# Altium schematic sheet Sheet2.SchDoc: Наименование
size 420 x 297 mm; ApprovedBy: Vasil; CheckedBy: Vasil; Author: Vasil; CompanyName: Vasil; DrawnBy: n.a.; Engineer: Vasil; SheetNumber: 2; SheetTotal: 5; PageSetup: Record=PageOptions|CenterHorizontal=True|CenterVertical=True|PrintScale=0.94|XCorrection=1.00|YCorrection=1.00|PrintKind=1|BorderSize=5000000|LeftOffset=0|BottomOffset=0|Orientation=1|PaperLength=1000|PaperWidth=1000|Scale=100|PaperSource=7|PrintQuality=-4|MediaType=1|DitherType=10|PaperKind=A4|PrintScaleMode=1; DecimalNumber: 000.00006.001.VG; HeadOfSector: n.a.; MainDevice: HW; Name: CNC_interfaces_board; DocumentName: Sheet1.SCHDOC
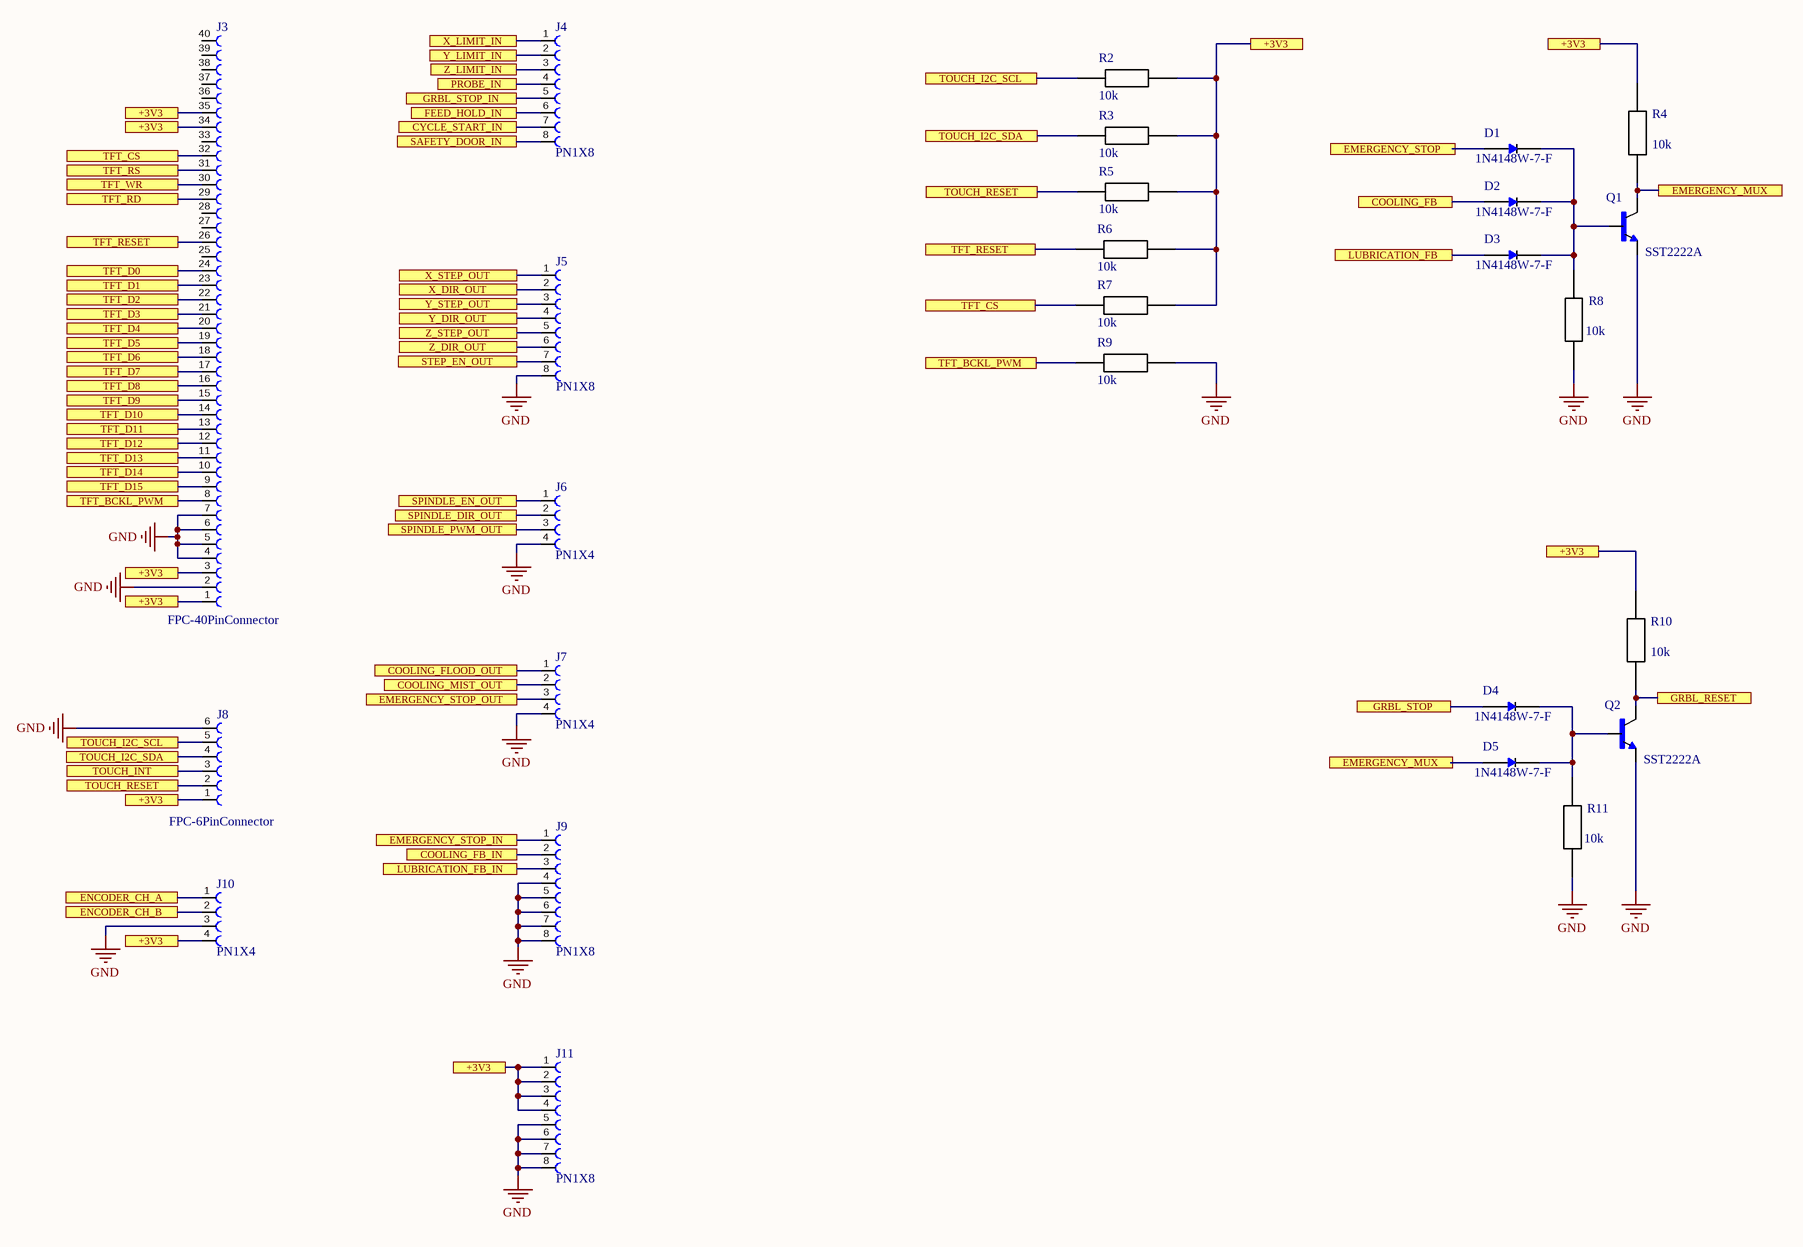
[diagram p0: Sheet2.SchDoc]

## Parts
D1  1N4148W-7-F  [SOD123]
D2  1N4148W-7-F  [SOD123]
D3  1N4148W-7-F  [SOD123]
D4  1N4148W-7-F  [SOD123]
D5  1N4148W-7-F  [SOD123]
J3  FPC-40PinConnector  [687140149022]
J4  PN1X8  [PN1X8]
J5  PN1X8  [PN1X8]
J6  PN1X4  [PN1X4]
J7  PN1X4  [PN1X4]
J8  FPC-6PinConnector  [687106149022]
J9  PN1X8  [PN1X8]
J10  PN1X4  [PN1X4]
J11  PN1X8  [PN1X8]
Q1  SST2222A  [SOT-23-3]
Q2  SST2222A  [SOT-23-3]
R2  10k  [SMD 0805]
R3  10k  [SMD 0805]
R4  10k  [SMD 0805]
R5  10k  [SMD 0805]
R6  10k  [SMD 0805]
R7  10k  [SMD 0805]
R8  10k  [SMD 0805]
R9  10k  [SMD 0805]
R10  10k  [SMD 0805]
R11  10k  [SMD 0805]

## Ports
+3V3, COOLING_FB, COOLING_FB_IN, COOLING_FLOOD_OUT, COOLING_MIST_OUT, CYCLE_START_IN, EMERGENCY_MUX, EMERGENCY_STOP, EMERGENCY_STOP_IN, EMERGENCY_STOP_OUT, ENCODER_CH_A, ENCODER_CH_B, FEED_HOLD_IN, GRBL_RESET, GRBL_STOP, GRBL_STOP_IN, LUBRICATION_FB, LUBRICATION_FB_IN, PROBE_IN, SAFETY_DOOR_IN, SPINDLE_DIR_OUT, SPINDLE_EN_OUT, SPINDLE_PWM_OUT, STEP_EN_OUT, TFT_BCKL_PWM, TFT_CS, TFT_D0, TFT_D1, TFT_D2, TFT_D3, TFT_D4, TFT_D5, TFT_D6, TFT_D7, TFT_D8, TFT_D9, TFT_D10, TFT_D11, TFT_D12, TFT_D13, TFT_D14, TFT_D15, TFT_RD, TFT_RESET, TFT_RS, TFT_WR, TOUCH_I2C_SCL, TOUCH_I2C_SDA, TOUCH_INT, TOUCH_RESET, X_DIR_OUT, X_LIMIT_IN, X_STEP_OUT, Y_DIR_OUT, Y_LIMIT_IN, Y_STEP_OUT, Z_DIR_OUT, Z_LIMIT_IN, Z_STEP_OUT

## Nets
GND: J3.2 J3.4 J3.5 J3.6 J3.7 J5.8 J6.4 J7.4 J8.6 J9.4 J9.5 J9.6 J9.7 J9.8 J10.3 J11.5 J11.6 J11.7 J11.8 Q1.1(E) Q2.1(E) R8.2 R9.2 R11.2
+3V3: J3.1 J3.3 J3.34 J3.35 J8.1 J10.4 J11.1 J11.2 J11.3 J11.4 R2.1 R3.2 R4.1 R5.2 R6.1 R7.1 R10.1 ; port +3V3
COOLING_FB: D2.A ; port COOLING_FB
COOLING_FB_IN: J9.2 ; port COOLING_FB_IN
COOLING_FLOOD_OUT: J7.1 ; port COOLING_FLOOD_OUT
COOLING_MIST_OUT: J7.2 ; port COOLING_MIST_OUT
CYCLE_START_IN: J4.7 ; port CYCLE_START_IN
EMERGENCY_MUX: D5.A Q1.3(C) R4.2 ; port EMERGENCY_MUX
EMERGENCY_STOP: D1.A ; port EMERGENCY_STOP
EMERGENCY_STOP_IN: J9.1 ; port EMERGENCY_STOP_IN
EMERGENCY_STOP_OUT: J7.3 ; port EMERGENCY_STOP_OUT
ENCODER_CH_A: J10.1 ; port ENCODER_CH_A
ENCODER_CH_B: J10.2 ; port ENCODER_CH_B
FEED_HOLD_IN: J4.6 ; port FEED_HOLD_IN
GRBL_RESET: Q2.3(C) R10.2 ; port GRBL_RESET
GRBL_STOP: D4.A ; port GRBL_STOP
GRBL_STOP_IN: J4.5 ; port GRBL_STOP_IN
LUBRICATION_FB: D3.A ; port LUBRICATION_FB
LUBRICATION_FB_IN: J9.3 ; port LUBRICATION_FB_IN
PROBE_IN: J4.4 ; port PROBE_IN
SAFETY_DOOR_IN: J4.8 ; port SAFETY_DOOR_IN
SPINDLE_DIR_OUT: J6.2 ; port SPINDLE_DIR_OUT
SPINDLE_EN_OUT: J6.1 ; port SPINDLE_EN_OUT
SPINDLE_PWM_OUT: J6.3 ; port SPINDLE_PWM_OUT
STEP_EN_OUT: J5.7 ; port STEP_EN_OUT
TFT_BCKL_PWM: J3.8 R9.1 ; port TFT_BCKL_PWM
TFT_CS: J3.32 R7.2 ; port TFT_CS
TFT_D0: J3.24 ; port TFT_D0
TFT_D1: J3.23 ; port TFT_D1
TFT_D2: J3.22 ; port TFT_D2
TFT_D3: J3.21 ; port TFT_D3
TFT_D4: J3.20 ; port TFT_D4
TFT_D5: J3.19 ; port TFT_D5
TFT_D6: J3.18 ; port TFT_D6
TFT_D7: J3.17 ; port TFT_D7
TFT_D8: J3.16 ; port TFT_D8
TFT_D9: J3.15 ; port TFT_D9
TFT_D10: J3.14 ; port TFT_D10
TFT_D11: J3.13 ; port TFT_D11
TFT_D12: J3.12 ; port TFT_D12
TFT_D13: J3.11 ; port TFT_D13
TFT_D14: J3.10 ; port TFT_D14
TFT_D15: J3.9 ; port TFT_D15
TFT_RD: J3.29 ; port TFT_RD
TFT_RESET: J3.26 R6.2 ; port TFT_RESET
TFT_RS: J3.31 ; port TFT_RS
TFT_WR: J3.30 ; port TFT_WR
TOUCH_I2C_SCL: J8.5 R2.2 ; port TOUCH_I2C_SCL
TOUCH_I2C_SDA: J8.4 R3.1 ; port TOUCH_I2C_SDA
TOUCH_INT: J8.3 ; port TOUCH_INT
TOUCH_RESET: J8.2 R5.1 ; port TOUCH_RESET
X_DIR_OUT: J5.2 ; port X_DIR_OUT
X_LIMIT_IN: J4.1 ; port X_LIMIT_IN
X_STEP_OUT: J5.1 ; port X_STEP_OUT
Y_DIR_OUT: J5.4 ; port Y_DIR_OUT
Y_LIMIT_IN: J4.2 ; port Y_LIMIT_IN
Y_STEP_OUT: J5.3 ; port Y_STEP_OUT
Z_DIR_OUT: J5.6 ; port Z_DIR_OUT
Z_LIMIT_IN: J4.3 ; port Z_LIMIT_IN
Z_STEP_OUT: J5.5 ; port Z_STEP_OUT
NetD1_C: D1.C(K) D2.C(K) D3.C(K) Q1.2(B) R8.1
NetD4_C: D4.C(K) D5.C(K) Q2.2(B) R11.1

Not connected (* = marked no-connect by the designer): J3 25(16) 27(14) 28(13) 33(8) 36(5) 37(4) 38(3) 39(2) 40(1)

## Notes on the sheet
- Перв.примен.
- Справ.№
- Подп. и дата
- Инв.№ дубл.
- Взам.инв.№
- Подп.и дата
- Разраб.
- Изм.
- Лист
- № докум.
- Подп.
- Дата
- Лит.
- Масштаб
- Масса
- Т.контр.
- Пров.
- СХЕМА   ЭЛЕКТРИЧЕСКАЯ
- ПРИНЦИПИАЛЬНАЯ
- Листов
- Инв.№ подл.
- Утв.
- Н.контр.
- Нач.сект.
- Формат  A3

## Library data of the parts
D1-D5 = 1N4148W-7-F: Diode Standard 100V 300mA _DC_ Surface Mount SOD-123; MF: DIODES / ZETEX; HelpURL: https://store.comet.bg/Catalogue/Product/9613/; Model: 1N4148W-7-F; Case: SOD-123 Diodes Inc.
J3 = FPC-40PinConnector: 40 Position FFC, FPC Connector Contacts, Bottom 0.020 (0.50mm) Surface Mount, Right Angle; MF: Wurth Electronics; Value: *; Check_prices: https://www.snapeda.com/parts/687140149022/Wurth+Electronics+Inc./view-part/?ref=eda; MP: 687140149022; Purchase-URL: https://pricing.snapeda.com/search/part/687140149022/?ref=eda; Price: None; Availability: In Stock; Package: None; SnapEDA_Link: https://www.snapeda.com/parts/687140149022/Wurth+Electronics+Inc./view-part/?ref=snap
J4 J5 J9 J11 = PN1X8: Single Row / Straight / Without Shroud Female header Female 8 ¦ WÃ¼rth Elektronik 61300711821 @ Pin header, socket _Si...; MF: WÃ¼rth Elektronik; Value: *; Price: None; MP: 61300711821; SnapEDA_Link: https://www.snapeda.com/parts/61300711821/W%C3%BCrth%20Elektronik/view-part/2704590/?ref=snap; Package: None; Availability: Unavailable
J6 J7 J10 = PN1X4: Single Row / Straight / Without Shroud Female header Female 4 @ Pin header, socket _Si...; MF: WÃ¼rth Elektronik; MP: 61300711821; Value: *; Price: None; SnapEDA_Link: https://www.snapeda.com/parts/61300711821/W%C3%BCrth%20Elektronik/view-part/2704590/?ref=snap; Package: None; Availability: Unavailable
J8 = FPC-6PinConnector: 6 Position FFC, FPC Connector Contacts, Bottom 0.020 (0.50mm) Surface Mount, Right Angle; MF: WÃ¼rth Elektronik; MP: 687106149022; Purchase-URL: https://pricing.snapeda.com/search/part/687106149022/?ref=eda; Price: None; SnapEDA_Link: https://www.snapeda.com/parts/687106149022/Wurth+Elektronik/view-part/?ref=snap; Check_prices: https://www.snapeda.com/parts/687106149022/Wurth+Elektronik/view-part/?ref=eda; Package: None; Availability: In Stock; Value: *
Q1 Q2 = SST2222A: Transistor NPN 40V 600mA 300MHz 350mW; Manufacturer: ROHM Semiconductor; Case: SOT-23-3 SST3; HelpURL: https://store.comet.bg/Catalogue/Product/23715/; Model: SST2222A
R2-R11 = Resistor_1: RES; HelpURL: https://store.comet.bg/Catalogue/RES/Resistors/#eyJpcHAiOiIxMDAiLCJtIjoiIn0%3D; Value: 10k